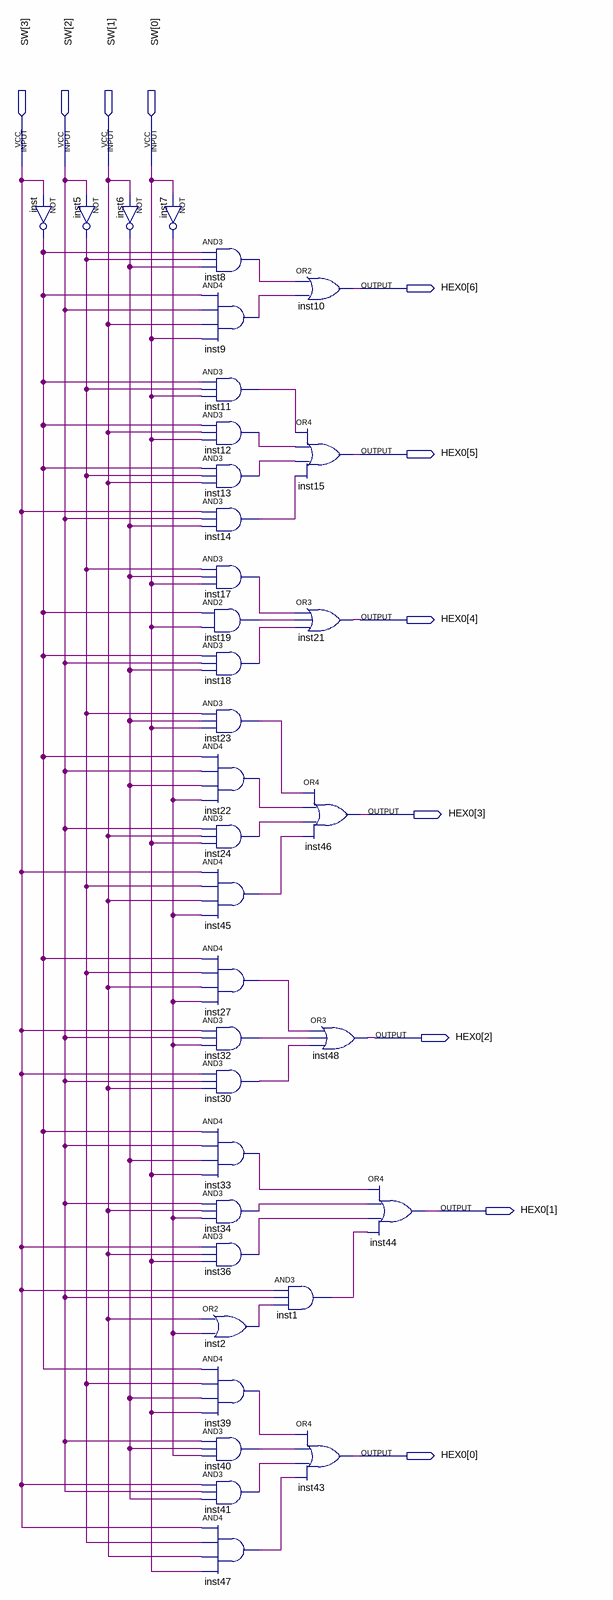
[diagram p0: schematic sheet]
// Quartus schematic DDCA_lab2.bdf as structural Verilog: 36 symbols, 11 pins
module DDCA_lab2 (
  input  [3:0] SW,
  output [6:0] HEX0
);

  wire inst1_out, inst2_out, inst5_out, inst6_out, inst7_out, inst8_out, inst9_out, inst11_out, inst12_out,
       inst13_out, inst14_out, inst17_out, inst18_out, inst19_out, inst22_out, inst23_out, inst24_out,
       inst27_out, inst30_out, inst32_out, inst33_out, inst34_out, inst36_out, inst39_out, inst40_out,
       inst41_out, inst45_out, inst47_out, inst_out;

  not inst (inst_out, SW[3]);
  not inst5 (inst5_out, SW[2]);
  not inst6 (inst6_out, SW[1]);
  not inst7 (inst7_out, SW[0]);
  and inst8 (inst8_out, inst_out, inst5_out, inst6_out);
  and inst9 (inst9_out, inst_out, SW[2], SW[1], SW[0]);
  and inst11 (inst11_out, inst_out, inst5_out, SW[0]);
  and inst12 (inst12_out, inst_out, SW[1], SW[0]);
  and inst13 (inst13_out, inst_out, inst5_out, SW[1]);
  and inst14 (inst14_out, SW[3], SW[2], inst6_out);
  and inst17 (inst17_out, inst5_out, inst6_out, SW[0]);
  and inst19 (inst19_out, inst_out, SW[0]);
  and inst18 (inst18_out, inst_out, SW[2], inst6_out);
  and inst23 (inst23_out, inst5_out, inst6_out, SW[0]);
  and inst22 (inst22_out, inst_out, SW[2], inst6_out, inst7_out);
  and inst24 (inst24_out, SW[2], SW[1], SW[0]);
  and inst45 (inst45_out, SW[3], inst5_out, SW[1], inst7_out);
  and inst27 (inst27_out, inst_out, inst5_out, SW[1], inst7_out);
  and inst32 (inst32_out, SW[3], SW[2], inst7_out);
  and inst30 (inst30_out, SW[3], SW[2], SW[1]);
  and inst33 (inst33_out, inst_out, SW[2], inst6_out, SW[0]);
  and inst34 (inst34_out, SW[2], SW[1], inst7_out);
  and inst36 (inst36_out, SW[3], SW[1], SW[0]);
  or inst2 (inst2_out, SW[1], inst7_out);
  and inst39 (inst39_out, inst_out, inst5_out, inst6_out, SW[0]);
  and inst40 (inst40_out, SW[2], inst6_out, inst7_out);
  and inst41 (inst41_out, SW[3], SW[2], inst6_out);
  and inst47 (inst47_out, SW[3], inst5_out, SW[1], SW[0]);
  and inst1 (inst1_out, SW[3], SW[2], inst2_out);
  or inst10 (HEX0[6], inst8_out, inst9_out);
  or inst15 (HEX0[5], inst11_out, inst12_out, inst13_out, inst14_out);
  or inst21 (HEX0[4], inst17_out, inst19_out, inst18_out);
  or inst46 (HEX0[3], inst23_out, inst22_out, inst24_out, inst45_out);
  or inst48 (HEX0[2], inst27_out, inst32_out, inst30_out);
  or inst43 (HEX0[0], inst39_out, inst40_out, inst41_out, inst47_out);
  or inst44 (HEX0[1], inst33_out, inst34_out, inst36_out, inst1_out);
endmodule
